# EAGLE design schemat2 (EAGLE 9.6.2)
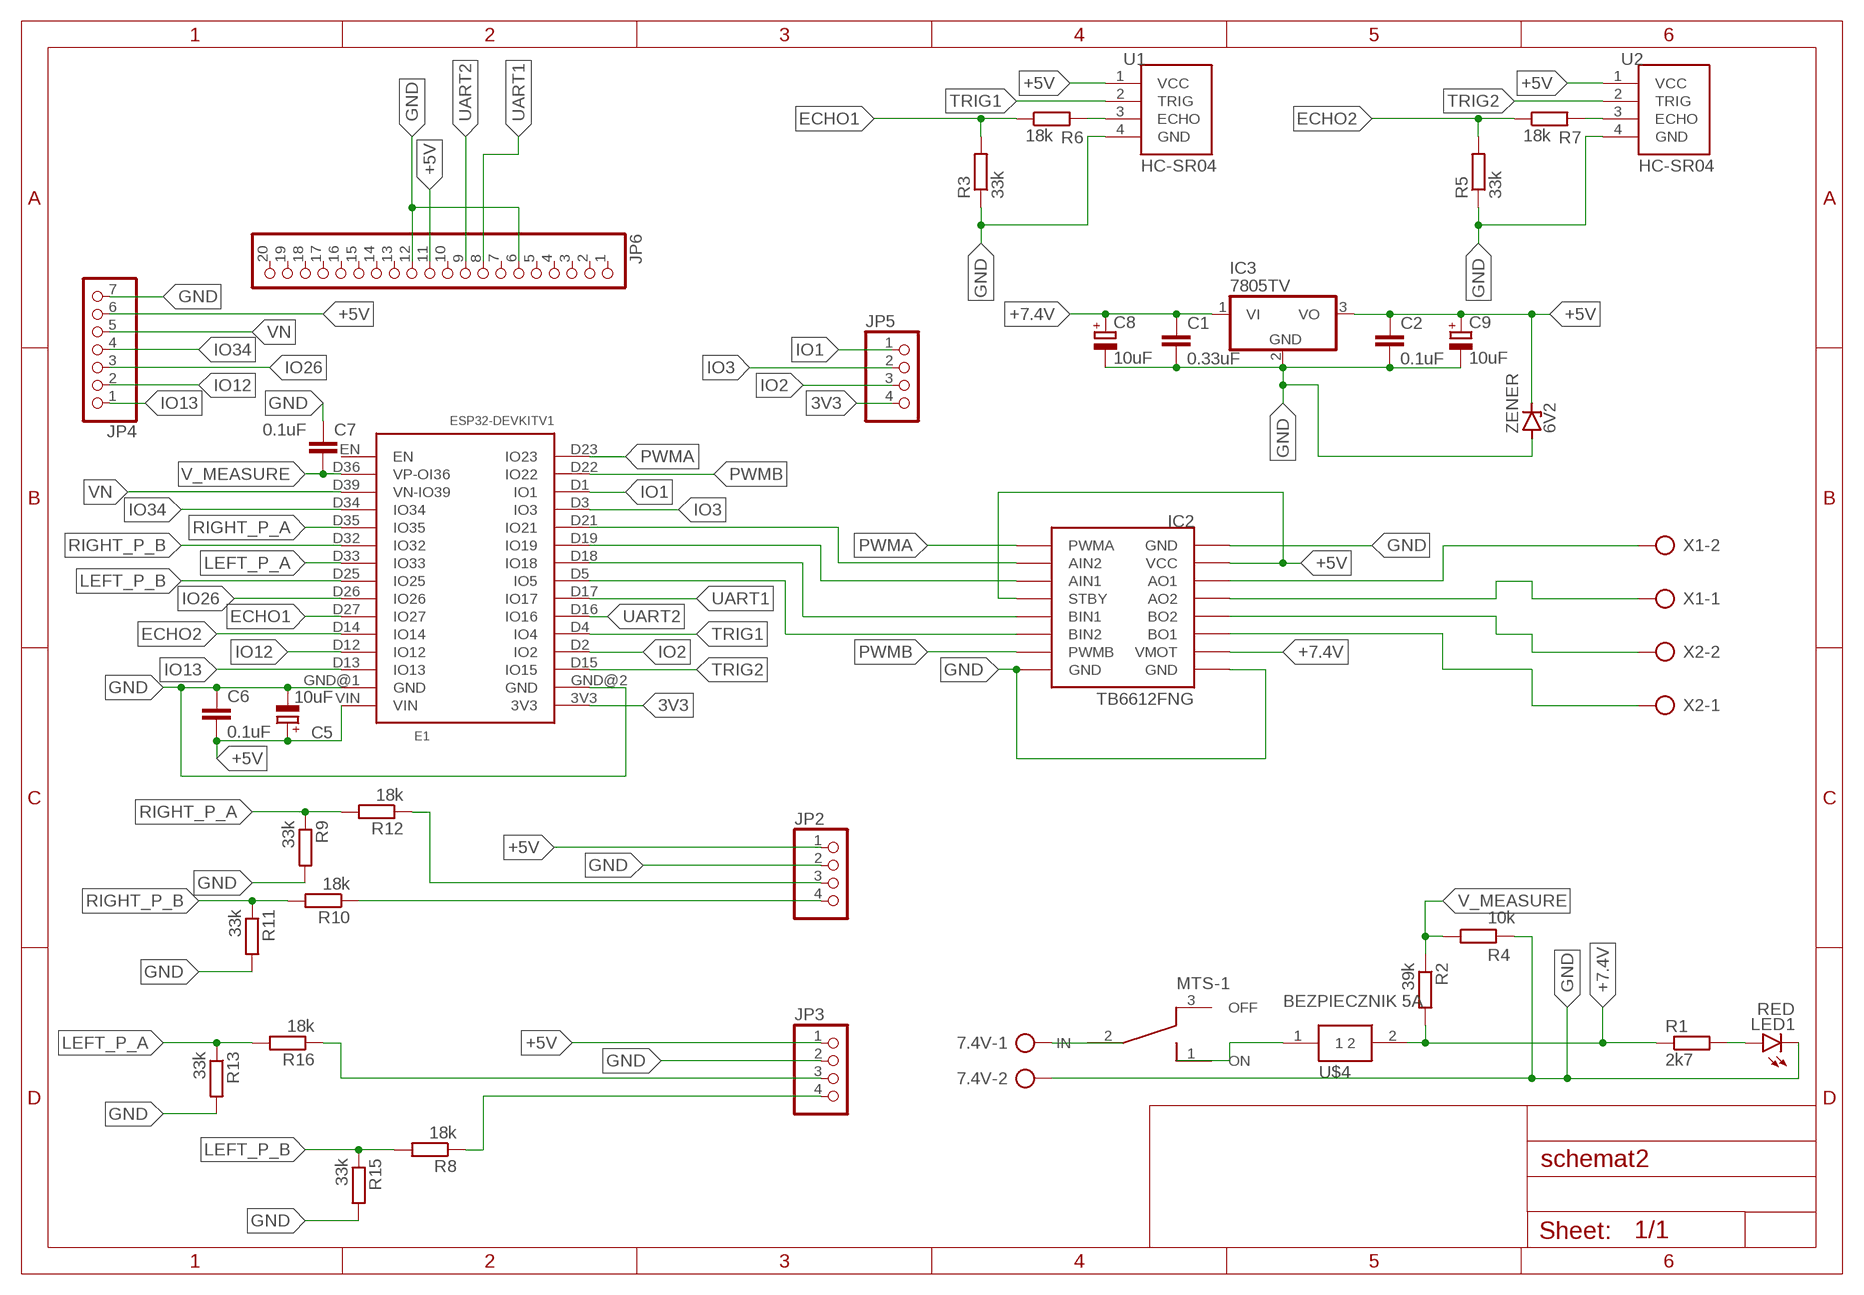
[diagram p0: schematic, sheet 1]

## Parts
7.4V  AK500/2  [AK500/2]
C1  0.33uF  C-EU025-024X044  [C025-024X044]
C2  0.1uF  C-EU025-024X044  [C025-024X044]
C5  10uF  CPOL-EUE2,5-6E  [E2,5-6E]
C6  0.1uF  C-EU025-024X044  [C025-024X044]
C7  0.1uF  C-EU025-024X044  [C025-024X044]
C8  10uF  CPOL-EUE2,5-6E  [E2,5-6E]
C9  10uF  CPOL-EUE2,5-6E  [E2,5-6E]
E1  ESP32DEVKITV1  [ESP32-DEVKITV1]
IC2  MODUL_POLOLU  [MODUL_POLOLU]
IC3  7805TV  [TO220V]
JP2  PINHD-1X4  [1X04]
JP3  PINHD-1X4  [1X04]
JP4  PINHD-1X7  [1X07]
JP5  PINHD-1X4  [1X04]
JP6  PINHD-1X20  [1X20]
LED1  RED  LED5MM  [LED5MM]
R1  2k7  R-EU_0207/5V  [0207/5V]
R2  39k  R-EU_0207/5V  [0207/5V]
R3  33k  R-EU_0207/5V  [0207/5V]
R4  10k  R-EU_0207/5V  [0207/5V]
R5  33k  R-EU_0207/5V  [0207/5V]
R6  18k  R-EU_0207/5V  [0207/5V]
R7  18k  R-EU_0207/5V  [0207/5V]
R8  18k  R-EU_0207/5V  [0207/5V]
R9  33k  R-EU_0207/5V  [0207/5V]
R10  18k  R-EU_0207/5V  [0207/5V]
R11  33k  R-EU_0207/5V  [0207/5V]
R12  18k  R-EU_0207/5V  [0207/5V]
R13  33k  R-EU_0207/5V  [0207/5V]
R15  33k  R-EU_0207/5V  [0207/5V]
R16  18k  R-EU_0207/5V  [0207/5V]
U1  HC-SR04  [XCVR_HC-SR04]
U2  HC-SR04  [XCVR_HC-SR04]
U$1  MTS-1  [SWITCH_TOGGLE]
U$4  BEZPIECZNIK 5A  BEZPIECZNIK  [BEZPIECZNIK_GNIAZDO]
X1  AK500/2  [AK500/2]
X2  AK500/2  [AK500/2]
ZENER  6V2  1N821  [DO35Z10]

## Nets
3V3: E1.3V3 JP5.4
+5V: C2.1 C5.+ C6.2 C9.+ E1.VIN IC2.STBY IC2.VCC IC3.3(VO) JP2.1 JP3.1 JP4.6 JP6.11 U1.1(VCC) U2.1(VCC) ZENER.C
+7.4V: C1.1 C8.+ IC2.VMOT IC3.1(VI) R1.1 R2.2 U$4.2
A: JP3.3 R16.1
A1: JP2.3 R12.1
B: JP3.4 R8.1
B1: JP2.4 R10.1
ECHO1: E1.D27(IO27) R3.2 R6.1
ECHO2: E1.D14(IO14) R5.2 R7.1
GND: 7.4V.2 C1.2 C2.2 C5.- C6.1 C7.1 C8.- C9.- E1.GND@1(GND) E1.GND@2(GND) IC2.GND1(GND) IC2.GND2(GND) IC2.GND3(GND) IC3.2(GND) JP2.2 JP3.2 JP4.7 JP6.6 JP6.12 LED1.K(C) R3.1 R4.2 R5.1 R9.2 R11.2 R13.2 R15.2 U1.4(GND) U2.4(GND) ZENER.A
IO1: E1.D1(IO1) JP5.1
IO2: E1.D2(IO2) JP5.3
IO3: E1.D3(IO3) JP5.2
IO12: E1.D12(IO12) JP4.2
IO13: E1.D13(IO13) JP4.1
IO26: E1.D26(IO26) JP4.3
IO34: E1.D34(IO34) JP4.4
L_MOT+: IC2.BO2 X2.2
L_MOT-: IC2.BO1 X2.1
LEFT_P_A: E1.D33(IO33) R13.1 R16.2
LEFT_P_B: E1.D25(IO25) R8.2 R15.1
N$1: LED1.A R1.2
N$2: R6.2 U1.3(ECHO)
N$3: R7.2 U2.3(ECHO)
N$4: 7.4V.1 U$1.2(IN)
N$5: E1.D5(IO5) IC2.BIN2
N$6: E1.D18(IO18) IC2.BIN1
N$7: E1.D21(IO21) IC2.AIN2
N$8: E1.D19(IO19) IC2.AIN1
N$9: U$1.1(ON) U$4.1
PWMA: E1.D23(IO23) IC2.PWMA
PWMB: E1.D22(IO22) IC2.PWMB
R_MOT+: IC2.AO1 X1.2
R_MOT-: IC2.A02(AO2) X1.1
RIGHT_P_A: E1.D35(IO35) R9.1 R12.2
RIGHT_P_B: E1.D32(IO32) R10.2 R11.1
TRIG1: E1.D4(IO4) U1.2(TRIG)
TRIG2: E1.D15(IO15) U2.2(TRIG)
UART1: E1.D17(IO17) JP6.8
UART2: E1.D16(IO16) JP6.9
V_MEASURE: C7.2 E1.D36(VP-OI36) R2.1 R4.1
VN: E1.D39(VN-IO39) JP4.5
Unconnected: E1.EN JP6.1 JP6.2 JP6.3 JP6.4 JP6.5 JP6.7 JP6.10 JP6.13 JP6.14 JP6.15 JP6.16 JP6.17 JP6.18 JP6.19 JP6.20 U$1.3(OFF)

## Library data of the parts
7.4V X1 X2 = con-ptr500:AK500/2: CONNECTOR; OC_FARNELL: unknown; OC_NEWARK: unknown
C1 C2 C6 C7 = rcl:C-EU: CAPACITOR, European symbol; SPICEPREFIX: C
C5 C8 C9 = rcl:CPOL-EU: POLARIZED CAPACITOR, European symbol; SPICEPREFIX: C
E1 = ESP32-DEVKITV1:ESP32DEVKITV1
IC2 = TB6612FNG:MODUL_POLOLU
IC3 = linear:78*: Positive VOLTAGE REGULATOR Source: http://cache.national.com/ds/LM/LM78L05.pdf http://www.fairchildsemi.com/ds/LM/LM7805.pdf
JP2 JP3 JP5 = pinhead:PINHD-1X4: PIN HEADER
JP4 = pinhead:PINHD-1X7: PIN HEADER
JP6 = pinhead:PINHD-1X20: PIN HEADER
LED1 = led:LED: LED OSRAM: - CHIPLED LG R971, LG N971, LY N971, LG Q971, LY Q971, LO R971, LY R971 LH N974, LH R974 LS Q976, LO Q976, LY Q976 LO Q996 - Hyper CHIPLED LW Q18S LB Q993, LB Q99A, LB R99A - SideLED LS A670, LO A670, LY A670, LG A670, LP A670 LB A673, LV A673, LT A673, LW A673 LH A674 LY A675 LS A676, LA A676, LO A676, LY A676, LW A676 LS A679, LY A679, LG A679 - Hyper Micro SIDELED® LS Y876, LA Y876, LO Y876, LY Y876 LT Y87S - SmartLED LW L88C, LW L88S LB L89C, LB L89S, LG L890 LS L89K, LO L89K, LY L89K LS L896, LA L896, LO L896, LY L896 - TOPLED LS T670, LO T670, LY T670, LG T670, LP T670 LSG T670, LSP T670, LSY T670, LOP T670, LYG T670 LG T671, LOG T671, LSG T671 LB T673, LV T673, LT T673, LW T673 LH T674 LS T676, LA T676, LO T676, LY T676, LB T676, LH T676, LSB T676, LW T676 LB T67C, LV T67C, LT T67C, LS T67K, LO T67K, LY T67K, LW E67C LS E67B, LA E67B, LO E67B, LY E67B, LB E67C, LV E67C, LT E67C LW T67C LS T679, LY T679, LG T679 LS T770, LO T770, LY T770, LG T770, LP T770 LB T773, LV T773, LT T773, LW T773 LH T774 LS E675, LA E675, LY E675, LS T675 LS T776, LA T776, LO T776, LY T776, LB T776 LHGB T686 LT T68C, LB T68C - Hyper Mini TOPLED® LB M676 - Mini TOPLED Santana® LG M470 LS M47K, LO M47K, LY M47K Source: http://www.osram.convergy.de LUXEON: - LUMILED® LXK2-PW12-R00, LXK2-PW12-S00, LXK2-PW14-U00, LXK2-PW14-V00 LXK2-PM12-R00, LXK2-PM12-S00, LXK2-PM14-U00 LXK2-PE12-Q00, LXK2-PE12-R00, LXK2-PE12-S00, LXK2-PE14-T00, LXK2-PE14-U00 LXK2-PB12-K00, LXK2-PB12-L00, LXK2-PB12-M00, LXK2-PB14-N00, LXK2-PB14-P00, LXK2-PB14-Q00 LXK2-PR12-L00, LXK2-PR12-M00, LXK2-PR14-Q00, LXK2-PR14-R00 LXK2-PD12-Q00, LXK2-PD12-R00, LXK2-PD12-S00 LXK2-PH12-R00, LXK2-PH12-S00 LXK2-PL12-P00, LXK2-PL12-Q00, LXK2-PL12-R00 Source: www.luxeon.com KINGBRIGHT: KA-3528ASYC Source: www.kingbright.com
R1-R13 R15 R16 = rcl:R-EU_: RESISTOR, European symbol; SPICEPREFIX: R
U1 U2 = HC-SR04:HC-SR04: Ultrasonic Sensor Module Check prices <https://pricing.snapeda.com/parts/HC-SR04/SparkFun%20Electronics/view-part?ref=eda>; AVAILABILITY: In Stock; DESCRIPTION: HC-SR04 Ultrasonic Sensor Qwiic Platform Evaluation Expansion Board; MF: SparkFun Electronics; MP: HC-SR04; PACKAGE: None; PRICE: None; PURCHASE-URL: https://pricing.snapeda.com/search/part/HC-SR04/?ref=eda
U$1 = motor:MTS-1
U$4 = motor:BEZPIECZNIK
ZENER = diode:1N821: Reference DIODE temperature compensated, 6,2 V

## Board
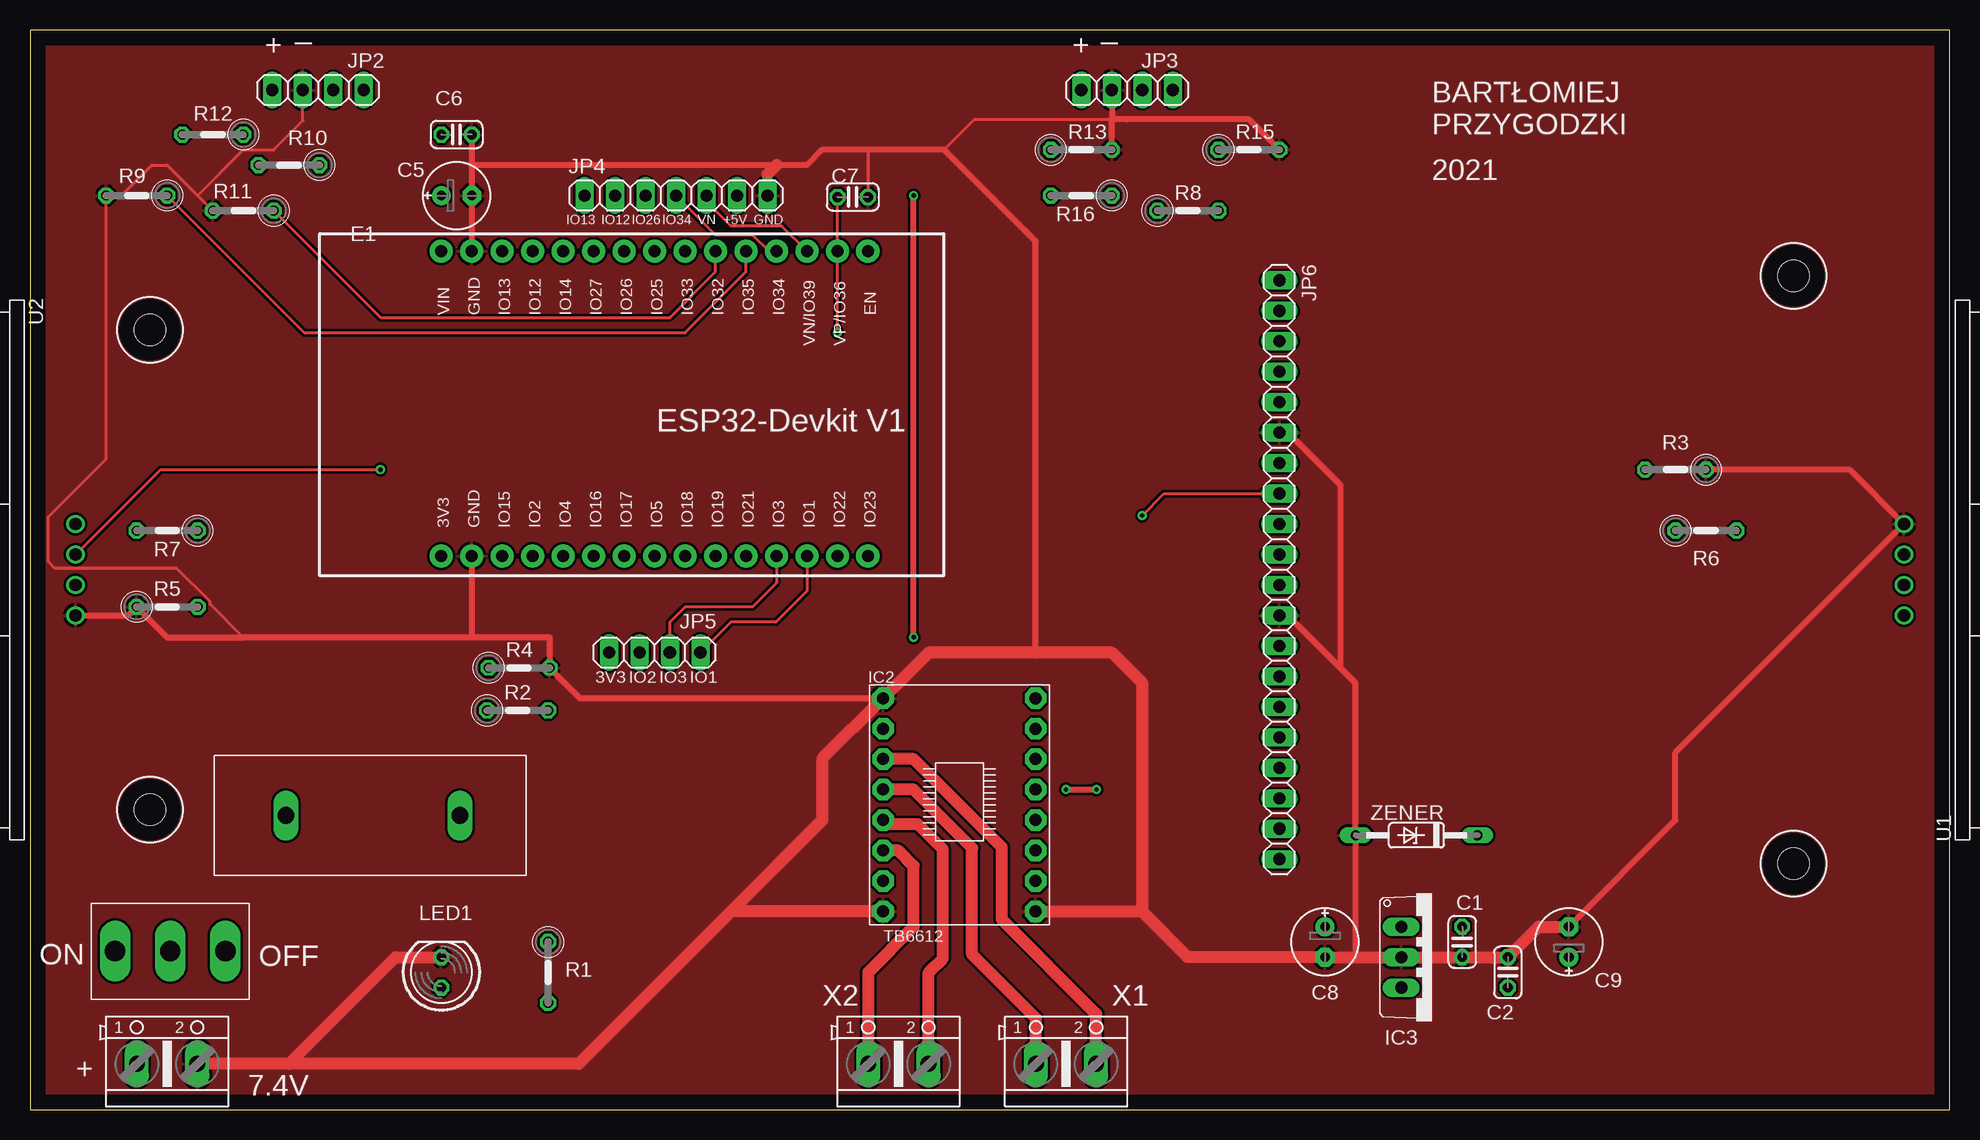
[diagram p1: board, top side]
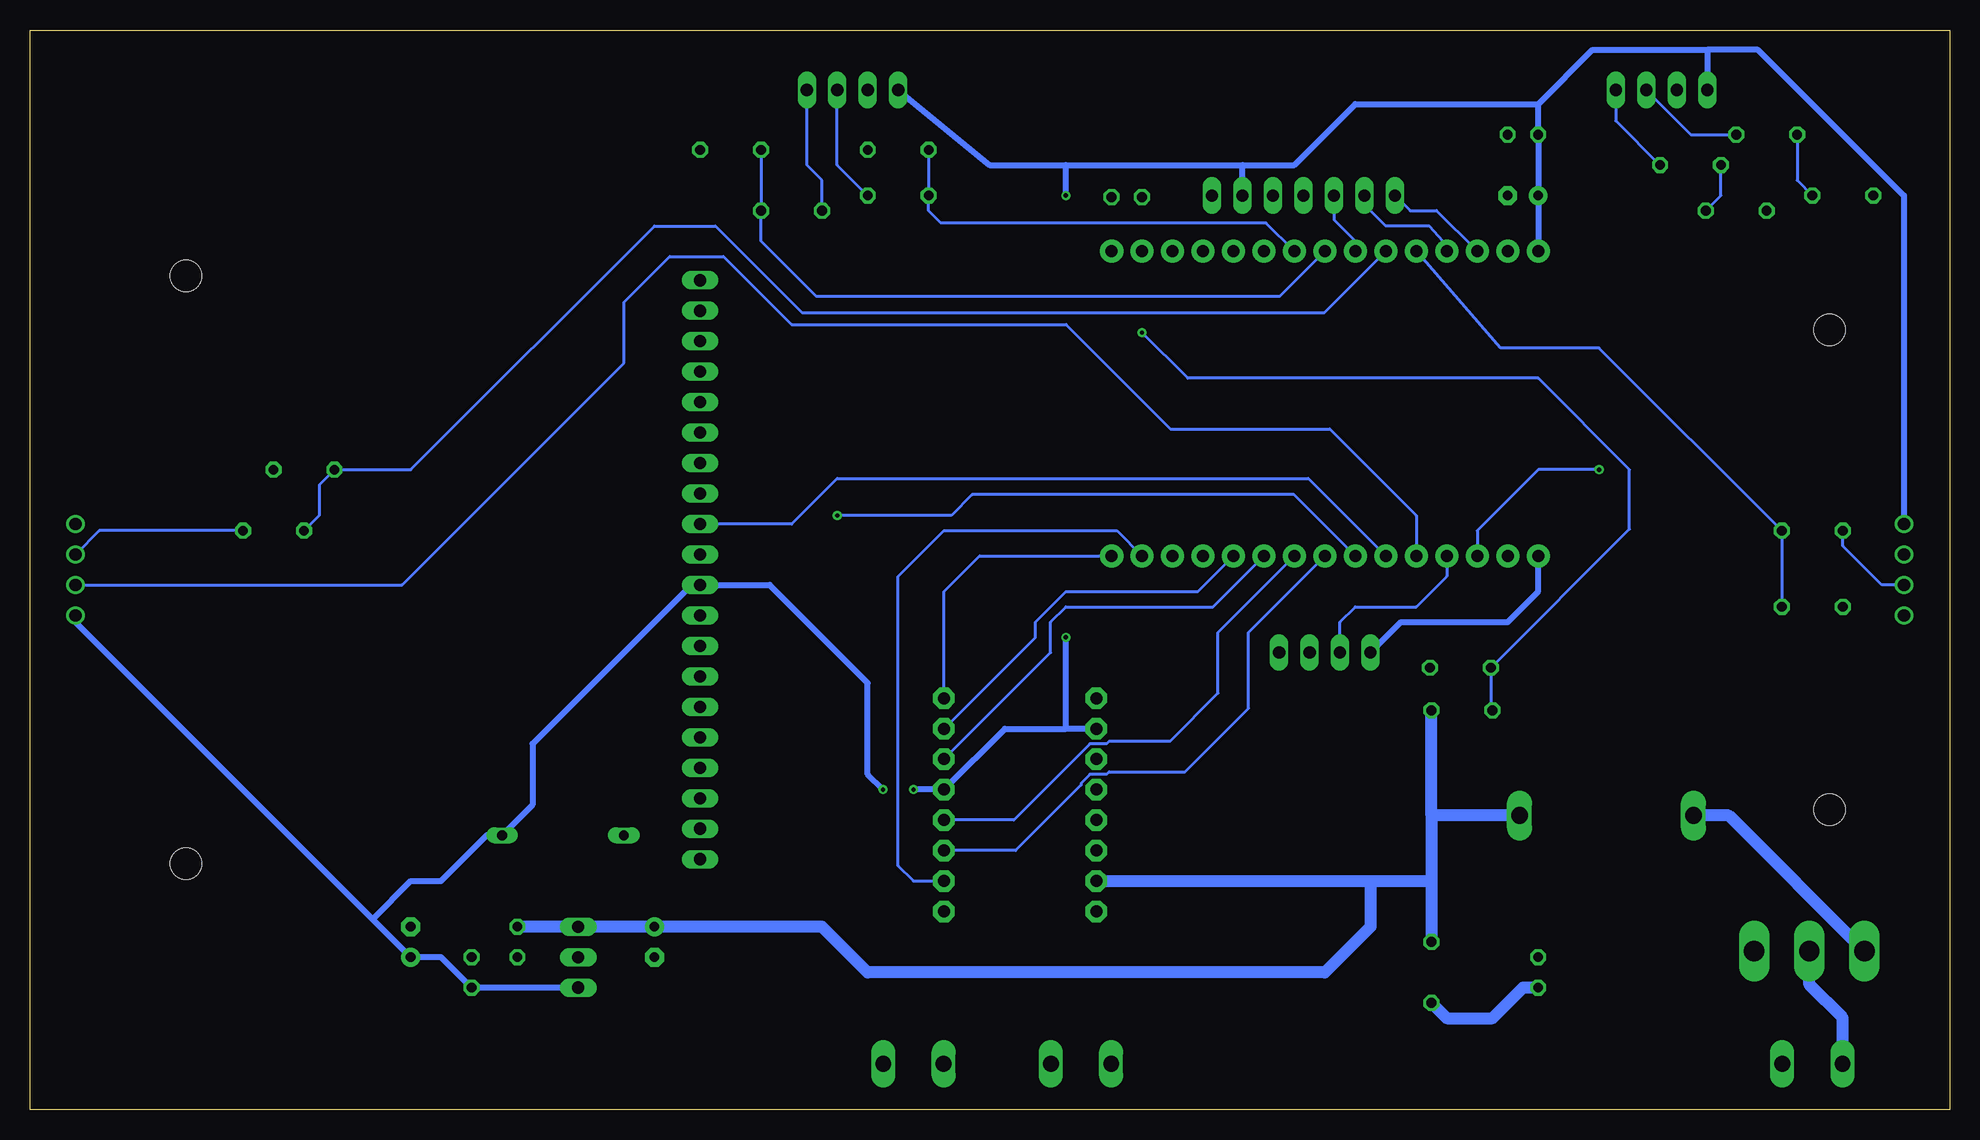
[diagram p2: board, bottom side, seen from below]

Size 160 x 90 mm. Coordinates in mm from the lower left corner, seen from the top.
Outline: 0,0 160,0 160,90 0,90 0,0
Copper layers (1*16): Top 0.035mm / dielectric 1.6mm / Bottom 0.035mm
Design rules "default *": minimum track width 6mil, minimum drill 0.35mm, track to track 8mil, track to pad 10mil, pad to pad 10mil, via to via 10mil, smd to smd 6mil, copper to edge 50mil, drill to drill 40mil, minimum pad ring 10mil, minimum via ring 8mil, stop-mask expansion 4mil, vias tented up to drill 0mil, thermal gap 10mil
Holes 2.6 mm at 10,65 10,25 147,20.5 147,69.5

### Footprints (pad centres in the part's own frame; a part is rotated, then mirrored left to right if it is on the bottom)
AK500/2 = drill 1.321 long: 1 -2.515,0; 2 2.515,0
C025-024X044 = drill 0.813 octagon: 1 -1.27,0; 2 1.27,0
E2,5-6E = drill 0.813 pad 1.575: + -1.27,0 | drill 0.813 pad 1.575 octagon: - 1.27,0
ESP32-DEVKITV1 = drill 1 pad 1.93: 3V3 -16.52,-12.27; D1 13.96,-12.27; D2 -8.9,-12.27; D3 11.42,-12.27; D4 -6.36,-12.27; D5 1.26,-12.27; D12 -8.9,13.135; D13 -11.44,13.135; D14 -6.36,13.135; D15 -11.44,-12.27; D16 -3.82,-12.27; D17 -1.28,-12.27; D18 3.8,-12.27; D19 6.34,-12.27; D21 8.88,-12.27; D22 16.5,-12.27; D23 19.04,-12.27; D25 1.26,13.135; D26 -1.28,13.135; D27 -3.82,13.135; D32 6.34,13.135; D33 3.8,13.135; D34 11.42,13.135; D35 8.88,13.135; D36 16.5,13.135; D39 13.96,13.135; EN 19.04,13.135; GND@1 -13.98,13.135; GND@2 -13.98,-12.27; VIN -16.52,13.135
MODUL_POLOLU = drill 1 pad 1.778 octagon: A02 -6.35,1.27; AIN1 6.35,3.81; AIN2 6.35,6.35; AO1 -6.35,3.81; BIN1 6.35,-1.27; BIN2 6.35,-3.81; BO1 -6.35,-3.81; BO2 -6.35,-1.27; GND1 -6.35,8.89; GND2 -6.35,-8.89; GND3 6.35,-8.89; PWMA 6.35,8.89; PWMB 6.35,-6.35; STBY 6.35,1.27; VCC -6.35,6.35; VMOT -6.35,-6.35
TO220V = drill 1.016 long: 1 -2.54,-2.54; 2 0,-2.54; 3 2.54,-2.54
1X04 = drill 1.016 long: 1 -3.81,0; 2 -1.27,0; 3 1.27,0; 4 3.81,0
1X07 = drill 1.016 long: 1 -7.62,0; 2 -5.08,0; 3 -2.54,0; 4 0,0; 5 2.54,0; 6 5.08,0; 7 7.62,0
1X20 = drill 1.016 long: 1 -24.13,0; 2 -21.59,0; 3 -19.05,0; 4 -16.51,0; 5 -13.97,0; 6 -11.43,0; 7 -8.89,0; 8 -6.35,0; 9 -3.81,0; 10 -1.27,0; 11 1.27,0; 12 3.81,0; 13 6.35,0; 14 8.89,0; 15 11.43,0; 16 13.97,0; 17 16.51,0; 18 19.05,0; 19 21.59,0; 20 24.13,0
LED5MM = drill 0.813 octagon: A -1.27,0; K 1.27,0
0207/5V = drill 0.813 octagon: 1 -2.54,0; 2 2.54,0
XCVR_HC-SR04 = drill 1.02: 1 -3.81,0; 2 -1.27,0; 3 1.27,0; 4 3.81,0
SWITCH_TOGGLE = drill 1.7 long: 1 -4.6,0; 2 0,0; 3 4.6,0
BEZPIECZNIK_GNIAZDO = drill 1.4 long: 1 0,0; 2 14.5,0
DO35Z10 = drill 0.813 long: A 5.08,0; C -5.08,0

### Placement (x,y rotation side)
7.4V  11.43,3.81 0 top
C1  119.38,13.97 270 top
C2  123.19,11.43 90 top
C5  35.56,76.2 0 top
C6  35.56,81.28 180 top
C7  68.58,76.07 180 top
C8  107.95,13.97 270 top
C9  128.27,13.97 90 top
E1  50.8,58.42 0 top
IC2  77.47,25.4 0 top
IC3  116.84,12.7 270 top
JP2  24,85 0 top
JP3  91.44,85 0 top
JP4  53.85,76.2 0 top
JP5  52.07,38.1 180 top
JP6  104.14,45 270 top
LED1  34.29,11.43 90 top
R1  43.18,11.43 270 top
R2  40.64,33.27 0 top
R3  137.16,53.34 180 top
R4  40.77,36.83 0 top
R5  11.43,41.91 0 top
R6  139.7,48.26 0 top
R7  11.43,48.26 180 top
R8  96.52,74.93 0 top
R9  8.89,76.2 180 top
R10  21.59,78.74 180 top
R11  17.78,74.93 180 top
R12  15.24,81.28 180 top
R13  87.63,80.01 0 top
R15  101.6,80.01 0 top
R16  87.63,76.2 180 top
U1  156.2,45 90 top
U2  3.8,45 270 top
U$1  11.68,13.21 0 top
U$4  21.34,24.51 0 top
X1  86.36,3.81 0 top
X2  72.39,3.81 0 top
ZENER  115.57,22.86 180 top

### Tracks (layer width: path | path; a pad name or v marks a point on that pad's centre or on a via)
3V3
  Bottom 0.508: JP5.4 45.72,40.64 36.83,40.64 34.28,43.19 E1.3V3
+5V  (via drill 0.35)
  Top 0.508: v86.36,26.67 v88.9,26.67 | v73.66,39.37 v73.66,76.2
  Bottom 0.508: IC3.3 C2.1 125.73,12.7 C9.+ 131.44,15.88 | 131.44,15.88 128.27,19.05 125.73,19.05 121.92,22.86 ZENER.C 118.11,25.4 118.11,30.48 104.86,43.73 JP6.11 98.34,43.73 90.17,35.56 90.17,27.94 v88.9,26.67 | 34.29,83.82 49.53,83.82 54.61,78.74 58.93,78.74 | 73.66,78.74 58.93,78.74 | U1.1 156.21,40.64 131.44,15.88 | JP3.1 80.01,78.74 73.66,78.74 | v73.66,76.2 73.66,78.74 | IC2.VCC 73.66,31.75 | 20.19,88.35 29.76,88.35 34.29,83.82 | 20.19,88.35 15.96,88.35 3.81,76.2 U2.1 | v86.36,26.67 IC2.STBY 78.74,31.75 73.66,31.75 | 73.66,31.75 v73.66,39.37 | 34.29,83.82 C6.2 C5.+ E1.VIN | 20.19,88.35 JP2.1 | JP4.6 58.93,78.74
+7.4V
  Bottom 1.016: U$4.2 43.18,24.51 | 43.18,24.51 R2.2 | 43.18,24.51 43.18,19.05 | 43.18,19.05 R1.1 | IC2.VMOT 48.26,19.05 | 48.26,19.05 43.18,19.05 | 48.26,19.05 48.26,15.24 52.07,11.43 90.17,11.43 93.98,15.24 C8.+ IC3.1 C1.1
A
  Bottom 0.254: JP3.3 92.71,78.74 R16.1
A1
  Bottom 0.254: JP2.3 21.57,81.28 R12.1
B
  Bottom 0.254: R8.1 93.98,77.47 95.25,78.74 JP3.4
B1
  Bottom 0.254: JP2.4 27.81,82.42 R10.1
ECHO1
  Bottom 0.254: R6.1 135.89,49.53 135.89,52.07 R3.2 128.27,53.34 107.95,73.66 102.87,73.66 95.63,66.42 52.11,66.42 E1.D27
ECHO2
  Bottom 0.254: R5.2 R7.1 29.21,63.5 37.43,63.5 E1.D14
GND
  Top 0.254: 17.78,39.37 15.01,42.14 15.01,42.34 12.23,45.12 2.06,45.12 1.52,45.67 1.52,49.41 6.35,54.24 R9.2 7.62,76.2 10.16,78.74 11.43,78.74 13.97,76.2 | 13.97,76.2 R11.2 | 13.97,76.2 17.78,80.01 20.32,80.01 22.73,82.42 JP2.2 | 69.85,80.01 C7.1 | 76.2,80.01 78.74,82.55 91.44,82.55
  Top 0.508: C6.1 36.83,78.74 | 36.83,78.74 C5.- E1.GND@1 | IC2.GND1 45.85,34.29 R4.2 43.31,39.37 36.83,39.37 | C9.- 137.16,24.13 137.16,29.76 U1.4 151.68,53.34 R3.1 | 110.49,12.7 ZENER.A 110.49,35.56 109.22,36.83 | 109.22,36.83 104.86,41.19 JP6.12 | 109.22,36.83 109.22,52.07 104.86,56.43 JP6.6 | U2.4 8.17,41.19 R5.1 11.43,39.37 17.78,39.37 36.83,39.37 | JP3.2 90.17,82.55 | R13.2 90.17,82.55 | R15.2 101.6,82.55 91.44,82.55 90.17,82.55 | 83.82,38.1 83.82,72.39 76.2,80.01 69.85,80.01 66.04,80.01 64.77,78.74 62.23,78.74 36.83,78.74 | E1.GND@2 36.83,39.37 | 61.47,77.98 JP4.7
  Top 1.016: LED1.K 30.48,12.7 21.59,3.81 | C9.- 125.73,15.24 C2.2 C1.2 IC3.2 110.49,12.7 C8.- 96.52,12.7 92.71,16.51 | 58.42,16.51 66.04,24.13 66.04,29.21 IC2.GND1 74.93,38.1 83.82,38.1 90.17,38.1 92.71,35.56 92.71,16.51 | IC2.GND2 58.42,16.51 | 58.42,16.51 45.72,3.81 21.59,3.81 | IC2.GND3 92.71,16.51 | 21.59,3.81 7.4V.2 | 61.47,77.98 62.23,78.74
  pour Top: 0,90.17 160.02,90.17 160.02,0 0,0
IO1
  Top 0.254: JP5.1 58.42,40.64 62.17,40.64 64.76,43.23 E1.D1
IO2
  Bottom 0.254: JP5.3 50.8,40.64 49.53,41.91 44.45,41.91 41.91,44.45 41.91,45.72 E1.D2 | E1.D2 | E1.D2
IO3
  Top 0.254: JP5.2 53.34,40.64 54.61,41.91 60.23,41.91 62.22,43.9 E1.D3
IO12
  Bottom 0.254: E1.D12 41.9,72.03 43.37,73.66 46.99,73.66 48.26,74.93 48.77,75.44 JP4.2
IO13
  Bottom 0.254: E1.D13 42.76,74.96 43.37,74.93 44.96,74.93 JP4.1
IO26
  Bottom 0.254: E1.D26 48.79,71.65 51.31,74.17 JP4.3
IO34
  Top 0.254: E1.D34 61.58,71.56 60.24,72.9 57.15,72.9 JP4.4
L_MOT+
  Top 1.016: IC2.BO2 71.12,23.78 74.01,23.78 76.1,21.69 76.1,12.62 74.91,11.43 X2.2
L_MOT-
  Top 1.016: X2.1 69.88,11.46 73.66,15.24 73.66,20.32 72.39,21.59 IC2.BO1
LEFT_P_A
  Bottom 0.254: R13.1 R16.2 85.09,74.93 84.07,73.91 56.96,73.91 E1.D33
LEFT_P_B
  Bottom 0.254: R15.1 R8.2 99.06,72.39 94.49,67.82 55.8,67.82 E1.D25
N$1
  Bottom 1.016: LED1.A 35.56,10.16 38.1,7.62 41.91,7.62 R1.2
N$2
  Bottom 0.254: R6.2 154.22,48.26 U1.3
N$3
  Bottom 0.254: U2.3 5.63,43.73 8.89,46.99 R7.2
N$4
  Bottom 1.016: 7.4V.1 8.91,7.64 11.68,10.41 U$1.2
N$5
  Bottom 0.254: IC2.BIN2 77.85,21.59 72.39,27.05 72.39,27.2 71.65,27.94 70.27,27.94 70.06,28.15 63.71,28.15 58.42,33.44 58.42,39.79 E1.D5
N$6
  Bottom 0.254: IC2.BIN1 78,24.13 71.65,30.48 70.27,30.48 70.06,30.69 64.98,30.69 60.96,34.71 60.96,39.79 E1.D18
N$7
  Bottom 0.254: IC2.AIN2 76.2,39.37 76.2,40.64 73.66,43.18 62.65,43.18 E1.D21
N$8
  Bottom 0.254: IC2.AIN1 74.93,38.1 74.93,40.64 73.66,41.91 61.38,41.91 E1.D19
N$9
  Bottom 1.016: U$4.1 18.41,24.51 7.11,13.21 U$1.1
PWMA
  Bottom 0.254: IC2.PWMA 83.82,43.18 80.85,46.15 E1.D23
PWMB
  Bottom 0.254: IC2.PWMB 86.36,19.05 87.63,20.32 87.63,44.45 83.82,48.26 69.41,48.26 E1.D22
R_MOT+
  Top 1.016: X1.2 88.88,7.99 81,15.87 81,21.87 73.66,29.21 IC2.AO1
R_MOT-
  Top 1.016: X1.1 83.84,7.62 78.54,12.93 78.54,21.79 73.66,26.67 IC2.A02
RIGHT_P_A
  Top 0.254: R9.1 22.86,64.77 54.61,64.77 59.68,69.84 E1.D35
  Bottom 0.254: R12.2 12.7,77.47 R9.1
RIGHT_P_B
  Top 0.254: R11.1 29.21,66.04 53.34,66.04 57.14,69.84 E1.D32
  Bottom 0.254: R11.1 19.05,76.2 R10.2
TRIG1
  Bottom 0.254: U1.2 128.99,43.73 110.49,62.23 110.49,67.31 106.68,71.12 102.19,71.12 96.52,65.45 73.64,65.45 64.94,56.74 51.66,56.74 44.44,49.52 E1.D4
TRIG2  (via drill 0.35)
  Top 0.254: U2.2 10.88,53.34 v29.21,53.34
  Bottom 0.254: v29.21,53.34 34.29,53.34 39.36,48.27 E1.D15
UART1  (via drill 0.35)
  Top 0.254: v92.71,49.53 94.53,51.35 JP6.8
  Bottom 0.254: v92.71,49.53 83.2,49.53 81.47,51.26 54.63,51.26 E1.D17
UART2
  Bottom 0.254: E1.D16 53.45,52.62 92.71,52.62 96.52,48.81 JP6.9
V_MEASURE  (via drill 0.35)
  Top 0.254: C7.2 E1.D36 67.3,71.12 67.31,71.11 v67.31,64.77
  Bottom 0.254: R2.1 38.23,33.4 R4.1 26.67,48.39 26.67,53.34 34.29,60.96 63.5,60.96 v67.31,64.77
VN
  Top 0.254: E1.D39 62.66,73.66 58.42,73.66 57.15,74.93 56.39,75.69 JP4.5

### Text on the board
tPlace: BARTŁOMIEJ / PRZYGODZKI | 2021
tNames: _ | _ | + | + | IO13 | IO12 | IO26 | IO34 | VN | +5V | GND | 3V3 | IO2 | IO3 | IO1 | ON | OFF | +